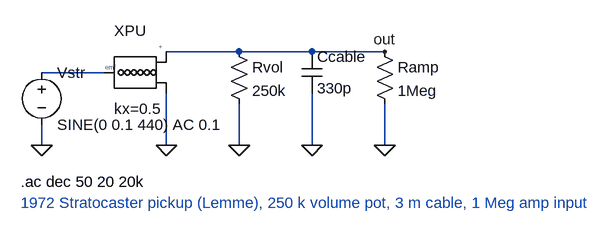
[diagram p0: schematic demo_guitar-pickup.asc]
demo_guitar-pickup.asc, the LTspice schematic file:
Version 4
SHEET 1 880 400
WIRE 128 128 224 128
WIRE 320 96 432 96
WIRE 432 96 544 96
WIRE 544 96 656 96
WIRE 128 208 128 240
WIRE 320 160 320 240
WIRE 432 176 432 240
WIRE 544 160 544 240
WIRE 656 176 656 240
FLAG 128 240 0
FLAG 320 240 0
FLAG 432 240 0
FLAG 544 240 0
FLAG 656 240 0
FLAG 656 96 out
SYMBOL voltage 128 112 R0
SYMATTR InstName Vstr
SYMATTR Value SINE(0 0.1 440) AC 0.1
SYMBOL PU_STRAT72 224 64 R0
SYMATTR InstName XPU
SYMATTR Value kx=0.5
SYMBOL res 416 80 R0
SYMATTR InstName Rvol
SYMATTR Value 250k
SYMBOL cap 528 96 R0
SYMATTR InstName Ccable
SYMATTR Value 330p
SYMBOL res 640 80 R0
SYMATTR InstName Ramp
SYMATTR Value 1Meg
TEXT 96 296 Left 2 !.ac dec 50 20 20k
TEXT 96 328 Left 2 ;1972 Stratocaster pickup (Lemme), 250 k volume pot, 3 m cable, 1 Meg amp input

The netlist it stands for:
* demo_guitar-pickup.asc
Vstr N001 0 SINE(0 0.1 440) AC 0.1
XXPU out 0 N001 PU_STRAT72 kx=0.5  ; pins OUT GND EMF
Rvol out 0 250k
Ccable out 0 330p
Ramp out 0 1Meg
.ac dec 50 20 20k
* 1972 Stratocaster pickup (Lemme), 250 k volume pot, 3 m cable, 1 Meg amp input
.lib guitar-pickup.sub
.backanno
.end